# Altium project ECE453Tutorial.PrjPCB (part 2 of 2)

## Sheet 04 Glove Sensors.SchDoc
size 355 x 304 mm
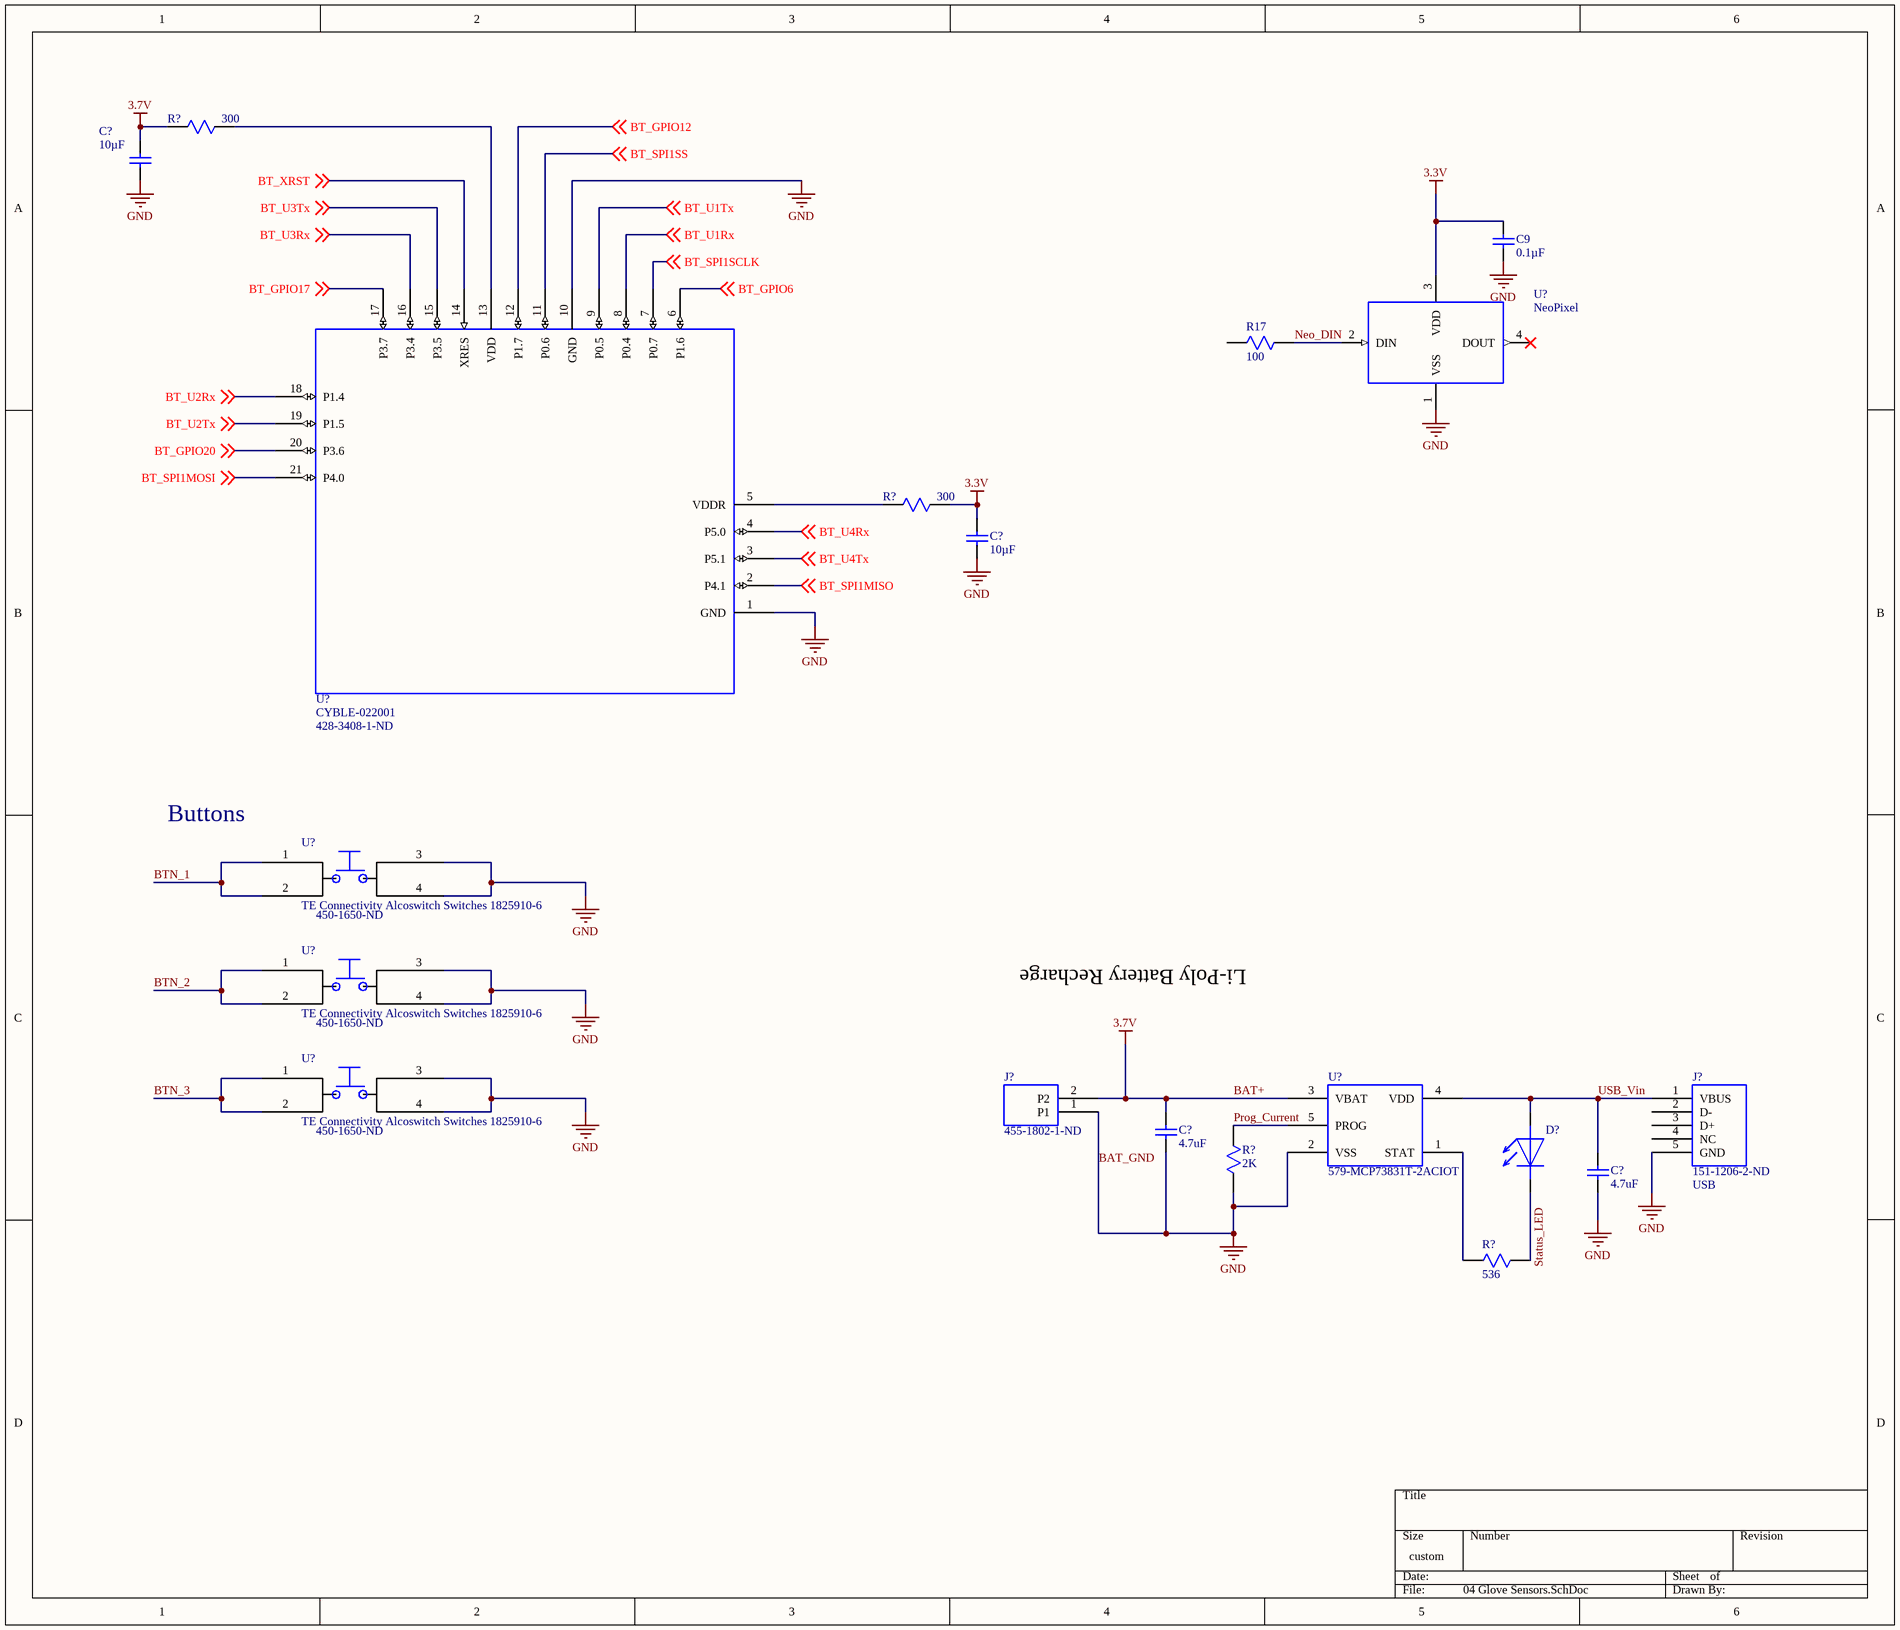
[diagram p6: 04 Glove Sensors.SchDoc]

### Parts
(Parts that share a designator on the sheet are numbered #1, #2 ... from top to bottom, then left to right.)
C9  value 0.1µF  [CAP_0805]  (hidden comment: CAP_0805_U_000_10)
C?#13  value 10µF  [CAP_0805]  (hidden comment: CAP_0805_U_010_00)
C?#14  value 10µF  [CAP_0805]  (hidden comment: CAP_0805_U_010_00)
C?#15  value 4.7uF  (hidden comment: CAP_4.7_uF)
C?#16  value 4.7uF  (hidden comment: CAP_4.7_uF)
D?#21  LNJ115W88RA  (value not drawn)
J?#2  Supplier Part Number 1: 455-1802-1-ND  (hidden comment: 455-1802-2-ND)
J?#3  value USB  (hidden comment: 151-1206-2-ND)
R17  value 100  [RES_0805]  (hidden comment: RES_0805_R_100_00)
R?#3  value 300  (hidden comment: RC0402JR-07300RL)
R?#4  value 300  (hidden comment: RC0402JR-07300RL)
R?#5  value 2K  (hidden comment: RMCF2010JT2K00)
R?#6  value 536  (hidden comment: ERJ-12SF5360U)
U?#7  NeoPixel  [WS2812B]
U?#8  TE Connectivity Alcoswitch Switches 1825910-6  Supplier Part Number 1: 450-1650-ND
U?#9  value CYBLE-022001  Supplier Part Number 1: 428-3408-1-ND  (hidden comment: CYBLE-022001-00)
U?#10  TE Connectivity Alcoswitch Switches 1825910-6  Supplier Part Number 1: 450-1650-ND
U?#11  TE Connectivity Alcoswitch Switches 1825910-6  Supplier Part Number 1: 450-1650-ND
U?#12  Supplier Part Number 1: 579-MCP73831T-2ACIOT  (hidden comment: MCP73831)

### Nets
3.3V: C9.2 C?#14.2 R?#4.2 U?#7.3(VDD)
BAT+: C?#13.2 C?#15.2 J?#2.2(P2) R?#3.1 U?#12.3(VBAT)  [also labelled 3.7V]
BAT_GND: C9.1 C?#13.1 C?#14.1 C?#15.1 C?#16.1 J?#2.1(P1) J?#3.5(GND) R?#5.2 U?#7.1(VSS) U?#8.3 U?#8.4 U?#9.1(GND) U?#9.10(GND) U?#10.3 U?#10.4 U?#11.3 U?#11.4 U?#12.2(VSS)  [also labelled GND]
BT_GPIO6: U?#9.6(P1.6) ; off-sheet BT_GPIO6
BT_GPIO12: U?#9.12(P1.7) ; off-sheet BT_GPIO12
BT_GPIO17: U?#9.17(P3.7) ; off-sheet BT_GPIO17
BT_GPIO20: U?#9.20(P3.6) ; off-sheet BT_GPIO20
BT_SPI1MISO: U?#9.2(P4.1) ; off-sheet BT_SPI1MISO
BT_SPI1MOSI: U?#9.21(P4.0) ; off-sheet BT_SPI1MOSI
BT_SPI1SCLK: U?#9.7(P0.7) ; off-sheet BT_SPI1SCLK
BT_SPI1SS: U?#9.11(P0.6) ; off-sheet BT_SPI1SS
BT_U1Rx: U?#9.8(P0.4) ; off-sheet BT_U1Rx
BT_U1Tx: U?#9.9(P0.5) ; off-sheet BT_U1Tx
BT_U2Rx: U?#9.18(P1.4) ; off-sheet BT_U2Rx
BT_U2Tx: U?#9.19(P1.5) ; off-sheet BT_U2Tx
BT_U3Rx: U?#9.16(P3.4) ; off-sheet BT_U3Rx
BT_U3Tx: U?#9.15(P3.5) ; off-sheet BT_U3Tx
BT_U4Rx: U?#9.4(P5.0) ; off-sheet BT_U4Rx
BT_U4Tx: U?#9.3(P5.1) ; off-sheet BT_U4Tx
BT_XRST: U?#9.14(XRES) ; off-sheet BT_XRST
BTN_1: U?#8.1 U?#8.2
BTN_2: U?#10.1 U?#10.2
BTN_3: U?#11.1 U?#11.2
Neo_DIN: R17.2 U?#7.2(DIN)
Prog_Current: R?#5.1 U?#12.5(PROG)
Status_LED: D?#21.?2 R?#6.2
USB_Vin: C?#16.2 D?#21.?1 J?#3.1(VBUS) U?#12.4(VDD)
NetR?#3_2: R?#3.2 U?#9.13(VDD)
NetR?#4_1: R?#4.1 U?#9.5(VDDR)
NetR?#6_1: R?#6.1 U?#12.1(STAT)

Not connected (* = marked no-connect by the designer): J?#3 2(D-) 3(D+) 4(NC); R17 1; U?#7 4(DOUT)*

### Notes on the sheet
- Buttons
- Li-Poly Battery Recharge

### Library data of the parts
C9 = CAP_0805_U_000_10: CAP CER 0.1UF 50V Y5V 0805; Manufacturer: Yageo; Manufacturer Part Number: CC0805ZRY5V9BB104; Tolerance: -20%, +80%; Temperature Coefficient: Y5V (F); Supplier 1: Digi-Key; Supplier Part Number 1: 311-1361-1-ND; RoHS: RoHS Compliant; Category: Capacitors; Stock 1: 86324; Pricing 1: 1=0.1, 10=0.031, 25=0.022, 100=0.0144, 250=0.01176, 500=0.01004, 1000=0.00783 (USD); Packaging: Cut Tape (CT); Voltage - Rated: 50V; Mounting Type: Surface Mount, MLCC; Operating Temperature: -30°C ~ 85°C; Applications: General Purpose; Ratings: -; Package / Case: 0805 (2012 Metric); Size / Dimension: 0.079" L x 0.049" W (2.00mm x 1.25mm); Height - Seated (Max): -; Thickness (Max): 0.024" (0.60mm); Lead Spacing: -; Features: -; Lead Style: -; ComponentLink1URL: http://www.yageo.com/documents/recent/UPY-GPHC_Y5V_6.3V-to-50V_5_revised.pdf; ComponentLink1Description: http://www.yageo.com/documents/recent/UPY-GPHC_Y5V_6.3V-to-50V_5_revised.pdf
C?#13 C?#14 = CAP_0805_U_010_00: CAP CER 10UF 10V X5R 0805; Manufacturer: Samsung Electro-Mechanics America, Inc.; Manufacturer Part Number: CL21A106KPCLQNC; Tolerance: ±10%; Supplier 1: Digi-Key; Supplier Part Number 1: 1276-2402-1-ND; RoHS: RoHS Compliant; Category: Capacitors; Stock 1: 97192; Pricing 1: 1=0.2, 10=0.14, 25=0.1052, 50=0.0806, 100=0.0665, 500=0.0469, 1000=0.0385 (USD); Packaging: Cut Tape (CT); Voltage - Rated: 10V; Temperature Coefficient: X5R; Mounting Type: Surface Mount, MLCC; Operating Temperature: -55°C ~ 85°C; Applications: General Purpose; Ratings: -; Package / Case: 0805 (2012 Metric); Size / Dimension: 0.079" L x 0.049" W (2.00mm x 1.25mm); Height - Seated (Max): -; Thickness (Max): 0.037" (0.95mm); Lead Spacing: -; Features: -; Lead Style: -; ComponentLink1URL: http://media.digikey.com/pdf/Data%20Sheets/Samsung%20PDFs/CL21A106KPCLQNC_character.pdf; ComponentLink1Description: http://media.digikey.com/pdf/Data%20Sheets/Samsung%20PDFs/CL21A106KPCLQNC_character.pdf
C?#15 C?#16 = CAP_4.7_uF: CAP_4.7uF; Manufacturer: Kemet; Manufacturer Part Number: C1206C475K4PACTU; Capacitance: 4.7µF; Tolerance: ±10%; Voltage - Rated: 16V; Temperature Coefficient: X5R; Supplier 1: Digi-Key; RoHS: RoHS Compliant; Category: Capacitors; Stock 1: 42893; Pricing 1: 1=0.3, 10=0.205, 50=0.124, 100=0.1042, 250=0.08432, 500=0.0744, 1000=0.06324 (USD); Packaging: Cut Tape (CT); Mounting Type: Surface Mount, MLCC; Operating Temperature: -55°C ~ 85°C; Applications: General Purpose; Ratings: -; Package / Case: 1206 (3216 Metric); Size / Dimension: 0.126" L x 0.063" W (3.20mm x 1.60mm); Height - Seated (Max): -; Thickness (Max): 0.071" (1.80mm); Lead Spacing: -; Features: -; Lead Style: -; ComponentLink1URL: http://www.kemet.com/docfinder?Partnumber=C1206C475K4PACTU; ComponentLink1Description: http://www.kemet.com/docfinder?Partnumber=C1206C475K4PACTU; Supplier Part Number 1: 399-1265-1-ND
D?#21 = LNJ115W88RA: Charger Indicator LED; Manufacturer: Panasonic; Illumination Color: Amber, Green; LED Size: 1.6 mm x 1.25 mm x 0.55 mm; Product Status: Obsolete; Supplier 1: Mouser; Manufacturer Part Number: LNJ115W88RA; RoHS: RoHS Compliant; Category: Standard LEDs - SMD; Stock 1: 0; Package / Case: 0605; Packaging: Reel; Series: LN; Brand: Panasonic; Mounting Style: SMD/SMT; Standard Pack Qty: 5000; RoHS - Mouser: Y; Minimum Order Quantity: 1; Reeling: True; ComponentLink1URL: http://industrial.panasonic.com/www-cgi/jvcr13pz.cgi?E+SC+4+ATA7006+LNJ115W88RA+8+WW; ComponentLink1Description: http://industrial.panasonic.com/www-cgi/jvcr13pz.cgi?E+SC+4+ATA7006+LNJ115W88RA+8+WW; Supplier Part Number 1: 667-LNJ115W88RA
J?#2 = 455-1802-2-ND: JST connector for LiPoly battery; Manufacturer: JST Sales America Inc.; Manufacturer Part Number: SM02B-SRSS-TB(LF)(SN); Connector Type: Header, Shrouded; Number of Positions: 2; Number of Positions Loaded: All; Pitch: 0.039" (1.00mm); Supplier 1: Digi-Key; RoHS: RoHS Compliant; Category: Connectors, Interconnects; Stock 1: 94260; Pricing 1: 1=0.51, 10=0.485, 25=0.4156, 50=0.3532, 100=0.3393, 250=0.30468, 500=0.29084, 1000=0.24237 (USD); Packaging: Cut Tape (CT); Contact Type: Male Pin; Number of Rows: 1; Row Spacing: -; Contact Mating Length: -; Mounting Type: Surface Mount, Right Angle; Termination: Solder; Fastening Type: -; Features: Solder Retention; Contact Finish: Tin; Contact Finish Thickness: -; Color: Natural; ComponentLink1URL: http://www.jst-mfg.com/product/pdf/eng/eSH.pdf; ComponentLink1Description: http://www.jst-mfg.com/product/pdf/eng/eSH.pdf
J?#3 = 151-1206-2-ND: Mini USB B port; Manufacturer: EDAC Inc.; Manufacturer Part Number: 690-005-299-043; Connector Type: USB - mini B; Number of Contacts: 5; Gender: Receptacle; Supplier 1: Digi-Key; RoHS: RoHS Compliant; Category: Connectors, Interconnects; Stock 1: 28500; Pricing 1: 750=0.185, 1500=0.166, 3750=0.16, 5250=0.15, 18750=0.135, 37500=0.133, 75000=0.13 (USD); Packaging: Tape & Reel (TR); Specifications: -; Mounting Type: Surface Mount, Right Angle, Horizontal; Features: Board Guide, Solder Retention; Ingress Protection: -; ComponentLink1URL: http://media.digikey.com/pdf/Data%20Sheets/EDAC%20PDFs/690-005-299-043_Dwg.pdf; ComponentLink1Description: http://media.digikey.com/pdf/Data%20Sheets/EDAC%20PDFs/690-005-299-043_Dwg.pdf; Supplier Part Number 1: 151-1206-2-ND
R17 = RES_0805_R_100_00: RES SMD 100 OHM 1% 1/8W 0805; Manufacturer: Yageo; Manufacturer Part Number: RC0805FR-07100RL; Power (Watts): 0.125W, 1/8W; Temperature Coefficient: ±100ppm/°C; Supplier 1: Digi-Key; Supplier Part Number 1: 311-100CRCT-ND; RoHS: RoHS Compliant; Category: Resistors; Stock 1: 1160362; Pricing 1: 1=0.1, 10=0.021, 25=0.0152, 100=0.0084, 250=0.00644, 500=0.00514, 1000=0.00379, 2500=0.00329 (USD); Packaging: Cut Tape (CT); Tolerance: ±1%; Composition: Thick Film; Features: Moisture Resistant; Operating Temperature: -55°C ~ 155°C; Package / Case: 0805 (2012 Metric); Supplier Device Package: 0805; Size / Dimension: 0.079" L x 0.049" W (2.00mm x 1.25mm); Height: 0.024" (0.60mm); Number of Terminations: 2; ComponentLink1URL: http://www.yageo.com/NewPortal/yageodocoutput?fileName=/pdf/R-Chip/PYu-RC_Group_51_RoHS_L_3.pdf; ComponentLink1Description: http://www.yageo.com/NewPortal/yageodocoutput?fileName=/pdf/R-Chip/PYu-RC_Group_51_RoHS_L_3.pdf
R?#3 R?#4 = RC0402JR-07300RL: RES SMD 300 OHM 5%; Manufacturer: Yageo; Power (Watts): 0.063W, 1/16W; Temperature Coefficient: ±100ppm/°C; Supplier 1: Digi-Key; Manufacturer Part Number: RC0402JR-07300RL; RoHS: RoHS Compliant; Category: Resistors; Stock 1: 32725; Pricing 1: 1=0.1, 10=0.012, 25=0.0084, 100=0.0047, 250=0.0036, 500=0.0029, 1000=0.00213, 2500=0.00185, 5000=0.00153 (USD); Packaging: Cut Tape (CT); Resistance (Ohms): 300; Tolerance: ±5%; Composition: Thick Film; Features: Moisture Resistant; Operating Temperature: -55°C ~ 155°C; Package / Case: 0402 (1005 Metric); Supplier Device Package: 0402; Size / Dimension: 0.039" L x 0.020" W (1.00mm x 0.50mm); Height: 0.016" (0.40mm); Number of Terminations: 2; ComponentLink1URL: http://www.yageo.com/NewPortal/yageodocoutput?fileName=/pdf/R-Chip/PYu-RC_Group_51_RoHS_L_3.pdf; ComponentLink1Description: http://www.yageo.com/NewPortal/yageodocoutput?fileName=/pdf/R-Chip/PYu-RC_Group_51_RoHS_L_3.pdf; Supplier Part Number 1: 311-300JRCT-ND
R?#5 = RMCF2010JT2K00: 2KOhm; Manufacturer: Stackpole Electronics Inc.; Tolerance: ±5%; Power (Watts): 0.75W, 3/4W; Temperature Coefficient: ±200ppm/°C; Supplier 1: Digi-Key; Manufacturer Part Number: RMCF2010JT2K00; RoHS: RoHS Compliant; Category: Resistors; Stock 1: 48064; Pricing 1: 1=0.21, 10=0.182, 50=0.0958, 100=0.071, 250=0.05444, 500=0.0429, 1000=0.0297 (USD); Packaging: Cut Tape (CT); Resistance (Ohms): 2k; Composition: Thick Film; Features: Automotive AEC-Q200; Operating Temperature: -55°C ~ 155°C; Package / Case: 2010 (5025 Metric); Supplier Device Package: 2010; Size / Dimension: 0.197" L x 0.098" W (5.00mm x 2.50mm); Height: 0.028" (0.70mm); Number of Terminations: 2; ComponentLink1URL: http://www.seielect.com/Catalog/SEI-RMCF_RMCP.pdf; ComponentLink1Description: http://www.seielect.com/Catalog/SEI-RMCF_RMCP.pdf; Supplier Part Number 1: RMCF2010JT2K00CT-ND
R?#6 = ERJ-12SF5360U: 536 Ohm Resistor; Manufacturer: Panasonic Electronic Components; Tolerance: ±1%; Power (Watts): 0.75W, 3/4W; Temperature Coefficient: ±100ppm/°C; Supplier 1: Digi-Key; Manufacturer Part Number: ERJ-12SF5360U; RoHS: RoHS Compliant; Category: Resistors; Stock 1: 7146; Pricing 1: 1=0.4, 50=0.1786, 100=0.1324, 250=0.10164, 500=0.08008, 1000=0.05544 (USD); Packaging: Cut Tape (CT); Resistance (Ohms): 536; Composition: Thick Film; Features: Automotive AEC-Q200; Operating Temperature: -55°C ~ 155°C; Package / Case: 2010 (5025 Metric); Supplier Device Package: 2010; Size / Dimension: 0.197" L x 0.098" W (5.00mm x 2.50mm); Height: 0.028" (0.70mm); Number of Terminations: 2; ComponentLink1URL: http://industrial.panasonic.com/www-cgi/jvcr13pz.cgi?E+PZ+3+AOA0002+ERJ12SF5360U+7+WW; ComponentLink1Description: http://industrial.panasonic.com/www-cgi/jvcr13pz.cgi?E+PZ+3+AOA0002+ERJ12SF5360U+7+WW; Supplier Part Number 1: P536ACCT-ND
U?#7 = WS2812B-MA: LED RGB WS2812B; Manufacturer: Adafruit Industries LLC; Manufacturer Part Number: 1655; Supplier 1: Digi-Key; Supplier Part Number 1: 1528-1104-ND; RoHS: RoHS Compliant; Category: Optoelectronics; Stock 1: 672; Pricing 1: 1=4.5, 10=4.05 (USD); ComponentLink1URL: http://www.adafruit.com/datasheets/WS2812B.pdf; ComponentLink1Description: http://www.adafruit.com/datasheets/WS2812B.pdf
U?#8 U?#10 U?#11 = TE Connectivity Alcoswitch Switches 1825910-6: Push buttons to handle playback; Circuit: SPST-NO; Switch Function: Off-Mom; Contact Rating @ Voltage: 0.05A @ 24VDC; Actuator Type: Standard; Actuator Height off PCB, from Pins: 5.00mm; Actuator Orientation: Top Actuated; Outline: 6.00mm x 6.00mm; Illumination: Non-Illuminated; Operating Force: 160gf; Actuator Material: Polybutylene Terephthalate (PBT); Switch Travel: 0.25mm; Mechanical Life: 100,000 Cycles; Supplier 1: Digi-Key; Manufacturer: TE Connectivity Alcoswitch Switches; Manufacturer Part Number: 1825910-6; RoHS: RoHS Compliant; Category: Switches; Stock 1: 50462; Pricing 1: 1=0.11, 25=0.1012, 50=0.0912, 100=0.0869, 250=0.08028, 500=0.07698, 1000=0.06268, 2000=0.05609, 5000=0.05278 (USD); Packaging: Bulk; Mounting Type: Through Hole; Termination Style: PC Pin; Illumination Voltage (Nominal): -; Illumination Type, Color: -; Ingress Protection: -; Features: -; Operating Temperature: -35°C ~ 85°C; ComponentLink1URL: http://www.te.com/commerce/DocumentDelivery/DDEController?Action=srchrtrv&DocNm=1825910&DocType=Customer+Drawing&DocLang=English; ComponentLink1Description: http://www.te.com/commerce/DocumentDelivery/DDEController?Action=srchrtrv&DocNm=1825910&DocType=Customer+Drawing&DocLang=English; Value: TE Connectivity Alcoswitch Switches 1825910-6
U?#9 = CYBLE-022001-00: EZ-BLE PRoC Module; Manufacturer: Cypress Semiconductor Corp; RF Family/Standard: Bluetooth; Protocol: Bluetooth v4.1 Low Energy (BLE); Frequency: 2.4GHz; Data Rate: 1Mbps; Power - Output: 3dBm; Sensitivity: -91dBm; Serial Interfaces: I²C, SPI, UART; Antenna Type: Integrated, Chip; Memory Size: 128kB Flash, 16kB SRAM; Voltage - Supply: 1.8 V ~ 4.5 V; Current - Receiving: 16.4mA; Current - Transmitting: 15.6mA; Supplier 1: Digi-Key; Manufacturer Part Number: CYBLE-022001-00; RoHS: RoHS Compliant; Category: RF/IF and RFID; Stock 1: 1211; Pricing 1: 1=11.9, 25=10.0084, 100=9.4675, 250=8.656 (USD); Packaging: Cut Tape (CT); Modulation: -; Mounting Type: Surface Mount; Operating Temperature: -40°C ~ 85°C; Package / Case: Module; ComponentLink1URL: http://www.cypress.com/file/140791/download; ComponentLink1Description: http://www.cypress.com/file/140791/download
U?#12 = MCP73831: Li-Polymer Charge Management Controller; Manufacturer: Microchip Technology; Manufacturer Part Number: MCP73831T-2ACI/OT; Output Current: 15 mA to 500 mA; Output Voltage: 4.2 V; Battery Type: Li-Ion, Li-Polymer; Operating Supply Voltage: 3.75 V to 6 V; Supplier 1: Mouser; RoHS: RoHS Compliant; Category: Battery Management; Stock 1: 22271; Pricing 1: 1=0.600, 10=0.560, 25=0.470, 100=0.420, 3000=0.420 (USD); Package / Case: SOT-23; Packaging: Reel; Series: MCP73831/2; Brand: Microchip Technology; Mounting Style: SMD/SMT; Maximum Operating Temperature: + 85 C; Minimum Operating Temperature: - 40 C; Product Category: Battery Management; Standard Pack Qty: 3000; RoHS - Mouser: Y; Minimum Order Quantity: 1; Reeling: True; ComponentLink1URL: http://www.mouser.com/ds/2/268/20001984g-846362.pdf; ComponentLink1Description: http://www.mouser.com/ds/2/268/20001984g-846362.pdf

## Nets that join several sheets
3.3V: 03 Arm Base Control Unit (14 pins), 04 Glove Sensors (C9.2 C?#14.2 R?#4.2 U?#7.3)
BAT_GND: 03 Arm Base Control Unit (59 pins), 02 Motor Power Regulators and Connectors (60 pins), 04 Glove Sensors (18 pins)
Vout: 03 Arm Base Control Unit (35 pins), 02 Motor Power Regulators and Connectors (C46.2 L7.?2 R20.1)
BT_GPIO6: 03 Arm Base Control Unit (J?#1.13 U?#6.6), 04 Glove Sensors (U?#9.6)
BT_GPIO12: 03 Arm Base Control Unit (J?#1.14 U?#6.12), 04 Glove Sensors (U?#9.12)
BT_GPIO17: 03 Arm Base Control Unit (J?#1.16 U?#6.17), 04 Glove Sensors (U?#9.17)
BT_GPIO20: 03 Arm Base Control Unit (J?#1.15 U?#6.20), 04 Glove Sensors (U?#9.20)
BT_SPI1MISO: 03 Arm Base Control Unit (J?#1.9 U?#6.2), 04 Glove Sensors (U?#9.2)
BT_SPI1MOSI: 03 Arm Base Control Unit (J?#1.12 U?#6.21), 04 Glove Sensors (U?#9.21)
BT_SPI1SCLK: 03 Arm Base Control Unit (J?#1.11 U?#6.7), 04 Glove Sensors (U?#9.7)
BT_SPI1SS: 03 Arm Base Control Unit (J?#1.10 U?#6.11), 04 Glove Sensors (U?#9.11)
BT_U1Rx: 03 Arm Base Control Unit (J?#1.1 U?#6.8), 04 Glove Sensors (U?#9.8)
BT_U1Tx: 03 Arm Base Control Unit (J?#1.2 U?#6.9), 04 Glove Sensors (U?#9.9)
BT_U2Rx: 03 Arm Base Control Unit (J?#1.3 U?#6.18), 04 Glove Sensors (U?#9.18)
BT_U2Tx: 03 Arm Base Control Unit (J?#1.4 U?#6.19), 04 Glove Sensors (U?#9.19)
BT_U3Rx: 03 Arm Base Control Unit (J?#1.5 U?#6.16), 04 Glove Sensors (U?#9.16)
BT_U3Tx: 03 Arm Base Control Unit (J?#1.6 U?#6.15), 04 Glove Sensors (U?#9.15)
BT_U4Rx: 03 Arm Base Control Unit (J?#1.7 U?#6.4), 04 Glove Sensors (U?#9.4)
BT_U4Tx: 03 Arm Base Control Unit (J?#1.8 U?#6.3), 04 Glove Sensors (U?#9.3)
BT_XRST: 03 Arm Base Control Unit (U?#6.14), 04 Glove Sensors (U?#9.14)
DC_MOTOR1+: 03 Arm Base Control Unit (D?#1.42 D?#8.41 U?#1.6 U?#1.7), 02 Motor Power Regulators and Connectors (J2.1 P2.1)
DC_MOTOR1-: 03 Arm Base Control Unit (D?#2.42 D?#7.41 U?#1.14 U?#1.15), 02 Motor Power Regulators and Connectors (J2.2 P2.2)
DC_MOTOR2+: 03 Arm Base Control Unit (D?#3.42 D?#10.41 U?#2.6 U?#2.7), 02 Motor Power Regulators and Connectors (J2.3 P2.3)
DC_MOTOR2-: 03 Arm Base Control Unit (D?#4.42 D?#9.41 U?#2.14 U?#2.15), 02 Motor Power Regulators and Connectors (J2.4 P2.4)
DC_MOTOR3+: 03 Arm Base Control Unit (8 pins), 02 Motor Power Regulators and Connectors (J2.5 J2.6 P2.5 P2.6)
DC_MOTOR4+: 03 Arm Base Control Unit (D?#13.42 D?#18.41 U?#4.6 U?#4.7), 02 Motor Power Regulators and Connectors (J2.7 P3.1)
DC_MOTOR4-: 03 Arm Base Control Unit (D?#14.42 D?#17.41 U?#4.14 U?#4.15), 02 Motor Power Regulators and Connectors (J2.8 P3.2)
DC_MOTOR5+: 03 Arm Base Control Unit (D?#15.42 D?#20.41 U?#5.6 U?#5.7), 02 Motor Power Regulators and Connectors (J2.9 P3.3)
DC_MOTOR5-: 03 Arm Base Control Unit (D?#16.42 D?#19.41 U?#5.14 U?#5.15), 02 Motor Power Regulators and Connectors (J2.10 P3.4)
Servo1_CTL: 03 Arm Base Control Unit (J?#1.21), 02 Motor Power Regulators and Connectors (J1.1)
Servo2_CTL: 03 Arm Base Control Unit (J?#1.22), 02 Motor Power Regulators and Connectors (J1.4)
Servo3_CTL: 03 Arm Base Control Unit (J?#1.23), 02 Motor Power Regulators and Connectors (J1.7)
Servo4_CTL: 03 Arm Base Control Unit (J?#1.24), 02 Motor Power Regulators and Connectors (J1.10)
Servo5_CTL: 03 Arm Base Control Unit (J?#1.25), 02 Motor Power Regulators and Connectors (J1.13)
Servo6_CTL: 03 Arm Base Control Unit (J?#1.26), 02 Motor Power Regulators and Connectors (J1.16)